# EAGLE design packaged (EAGLE 7.6.0)
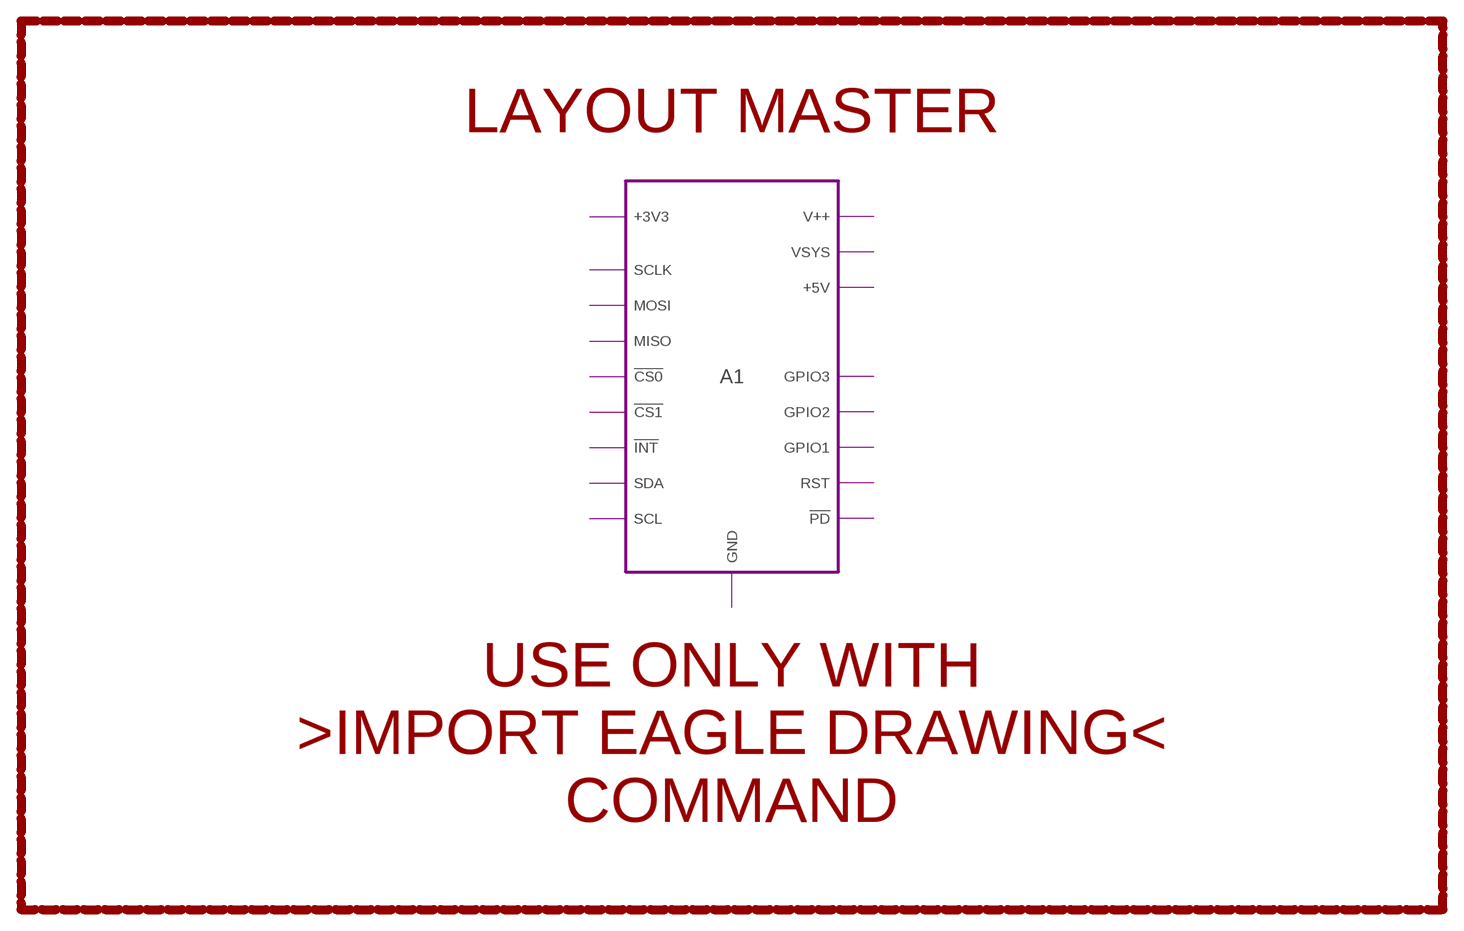
[diagram p0: schematic, sheet 1]

## Module instances
A1 = X1-TRACKBOARD3080

## Notes on the sheet
- LAYOUT MASTER
- USE ONLY WITH
  >IMPORT EAGLE DRAWING<
  COMMAND

## Library data of the parts

## Module X1-TRACKBOARD3080
Ports: !CS0(io) SCLK(io) MOSI(io) MISO(io) !CS1(io) !INT(io) SDA(io) SCL(io) GND(io) !PD(io) RST(io) GPIO1(io) GPIO2(io) GPIO3(io) +3V3(io) +5V(io) VSYS(io) V++(io)
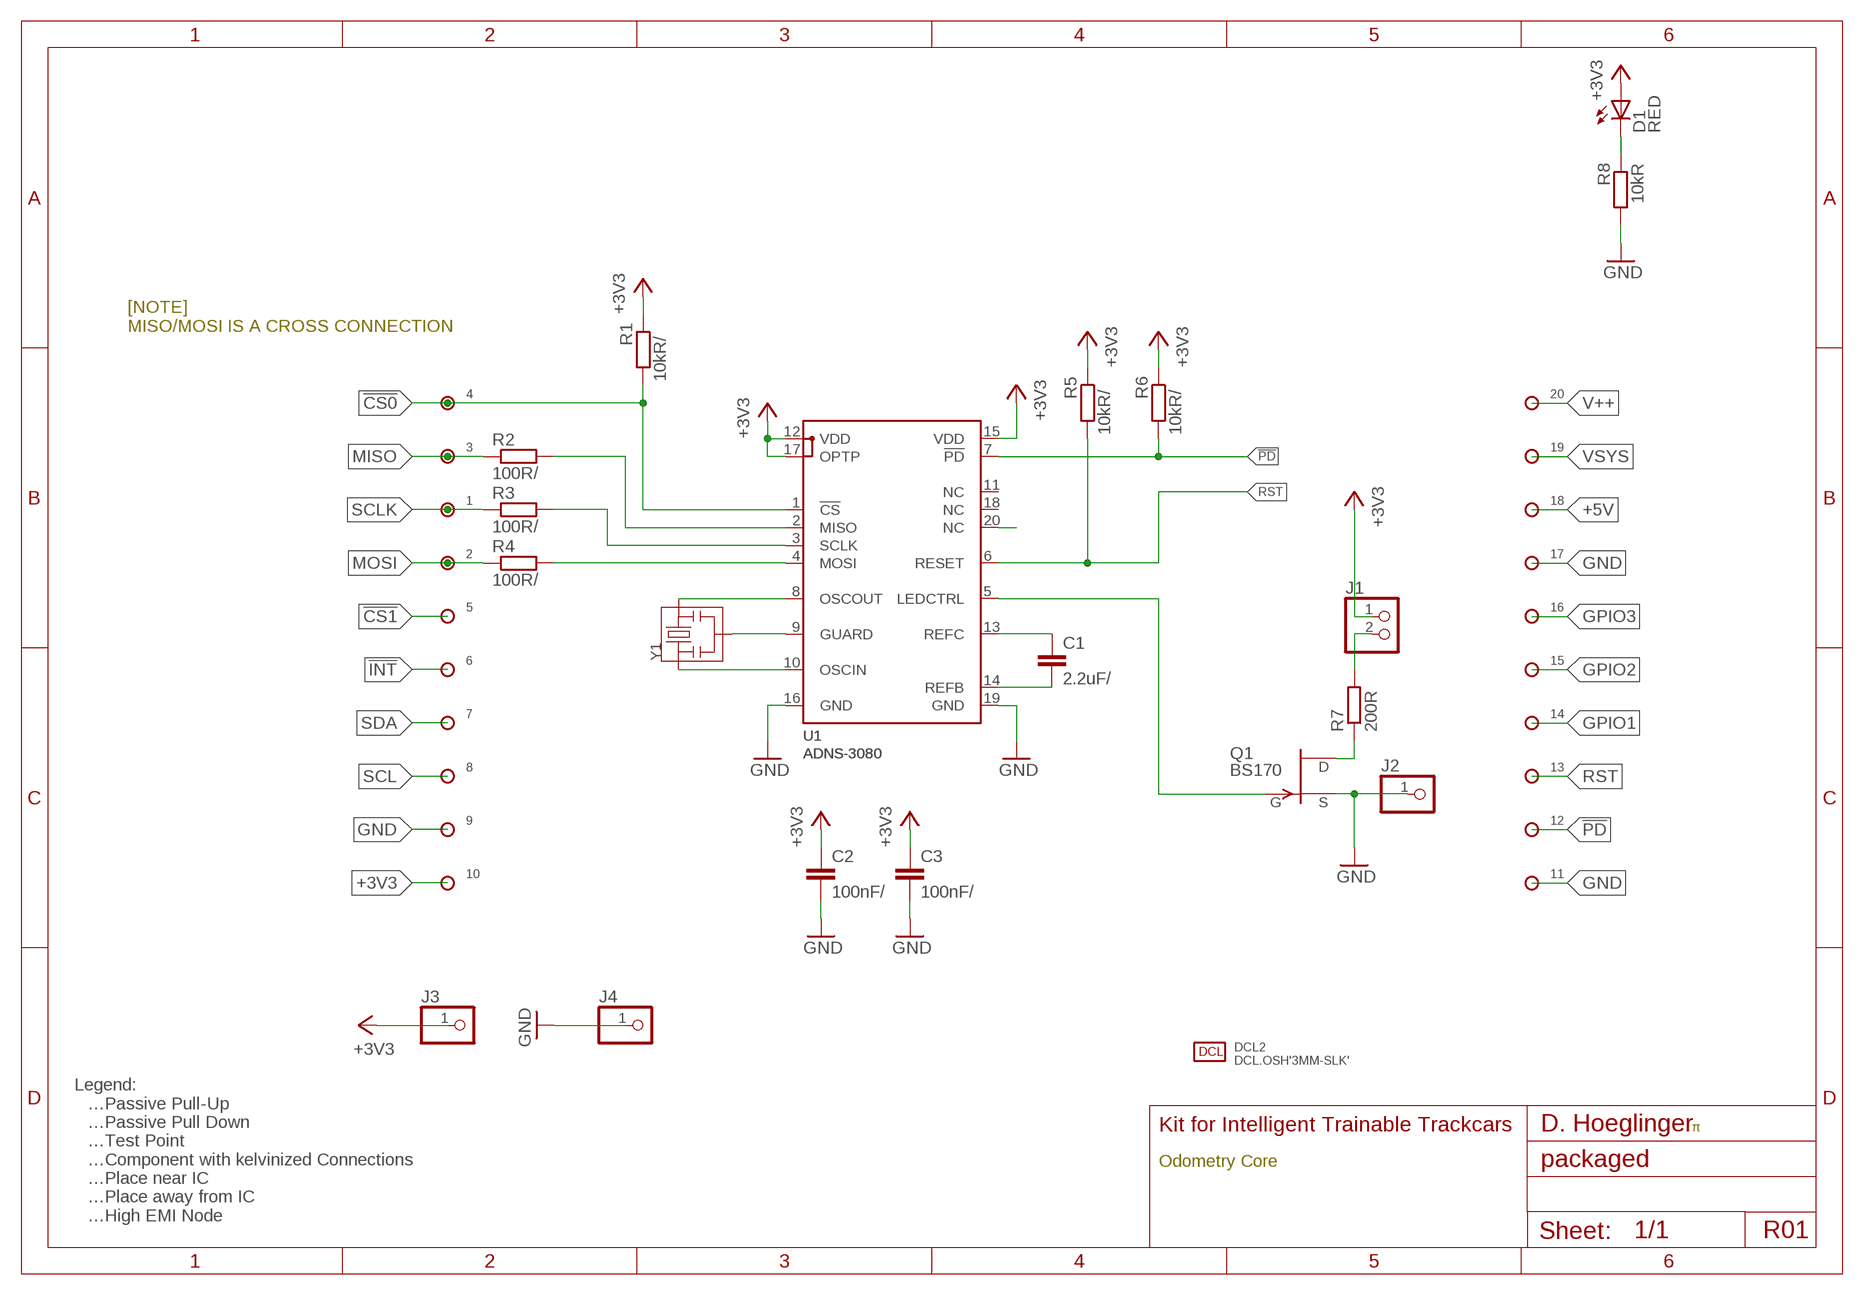
[diagram p1: schematic, module X1-TRACKBOARD3080, sheet 1]

### Parts
C1  2.2uF/⇤  C-EUC1608  [C1608]
C2  100nF/⇤  C-EUC0805K  [C0805K]
C3  100nF/⇤  C-EUC0805K  [C0805K]
D1  RED  LEDCHIP-LED0805  [CHIP-LED0805]
DCL2  DCL.OSH'3MM-SLK'  [DCL.LOGO-OSH.3MM]
J1  PINHD-1X2  [1X02]
J2  PINHD-1X1  [1X01]
J3  PINHD-1X1  [1X01]
J4  PINHD-1X1  [1X01]
Q1  BS170  SST5484  [SOT23]
R1  10kR/⎒  R-EU_R0402  [R0402]
R2  100R/⇤  R-EU_R0402  [R0402]
R3  100R/⇤  R-EU_R0402  [R0402]
R4  100R/⇤  R-EU_R0402  [R0402]
R5  10kR/⎒  R-EU_R0402  [R0402]
R6  10kR/⎒  R-EU_R0402  [R0402]
R7  200R  R-EU_R0805  [R0805]
R8  10kR  R-EU_R0402  [R0402]
U1  ADNS-3080  [ADNS-3080]
U$1  SIGNATURE  [SIG_DOMH]
Y1  24MHz  RESON  [RESON-SMD]
⌁1  SINGLEPAD40MIL  [PAD40MIL]
⌁2  SINGLEPAD40MIL  [PAD40MIL]
⌁3  SINGLEPAD40MIL  [PAD40MIL]
⌁4  SINGLEPAD40MIL  [PAD40MIL]
⌁5  SINGLEPAD40MIL  [PAD40MIL]
⌁6  SINGLEPAD40MIL  [PAD40MIL]
⌁7  SINGLEPAD40MIL  [PAD40MIL]
⌁8  SINGLEPAD40MIL  [PAD40MIL]
⌁9  SINGLEPAD40MIL  [PAD40MIL]
⌁10  SINGLEPAD40MIL  [PAD40MIL]
⌁11  SINGLEPAD40MIL  [PAD40MIL]
⌁12  SINGLEPAD40MIL  [PAD40MIL]
⌁13  SINGLEPAD40MIL  [PAD40MIL]
⌁14  SINGLEPAD40MIL  [PAD40MIL]
⌁15  SINGLEPAD40MIL  [PAD40MIL]
⌁16  SINGLEPAD40MIL  [PAD40MIL]
⌁17  SINGLEPAD40MIL  [PAD40MIL]
⌁18  SINGLEPAD40MIL  [PAD40MIL]
⌁19  SINGLEPAD40MIL  [PAD40MIL]
⌁20  SINGLEPAD40MIL  [PAD40MIL]

### Nets
!CS0: R1.2 U1.1(!CS) ⌁4.X
!CS1: ⌁5.X
!INT: ⌁6.X
!PD: R6.2 U1.7(!PD) ⌁12.X
+3V3: C2.1 C3.1 D1.A J1.1 J3.1 R1.1 R5.1 R6.1 U1.12(VDD) U1.15(VDD) U1.17(OPTP) ⌁10.X
+5V: ⌁18.X
GND: C2.2 C3.2 J2.1 J4.1 Q1.2(S) R8.2 U1.16(GND) U1.19(GND) ⌁9.X ⌁11.X ⌁17.X
GPIO1: ⌁14.X
GPIO2: ⌁15.X
GPIO3: ⌁16.X
MISO: R2.1 ⌁3.X
MOSI: R4.1 ⌁2.X
N$4: Q1.3(G) U1.5(LEDCTRL)
N$5: C1.1 U1.13(REFC)
N$6: C1.2 U1.14(REFB)
N$7: Q1.1(D) R7.1
N$8: J1.2 R7.2
N$9: U1.20(NC)
N$11: D1.C R8.1
RST: R5.2 U1.6(RESET) ⌁13.X
SCL: ⌁8.X
SCLK: R3.1 ⌁1.X
SDA: ⌁7.X
U1.GUARD: U1.9(GUARD) Y1.2
U1.MISO: R2.2 U1.2(MISO)
U1.MOSI: R4.2 U1.4(MOSI)
U1.OSCIN✳: U1.10(OSCIN) Y1.1
U1.OSCOUT✳: U1.8(OSCOUT) Y1.3
U1.SCLK: R3.2 U1.3(SCLK)
V++: ⌁20.X
VSYS: ⌁19.X
Unconnected: U1.11(NC) U1.18(NC)

### Notes on the sheet
- [NOTE]
  MISO/MOSI IS A CROSS CONNECTION
- Legend:
  ⎒…Passive Pull-Up
  ⎑…Passive Pull Down
  ☇…Test Point
  ⚻…Component with kelvinized Connections
  ⇤…Place near IC
  ↦…Place away from IC
  ✳…High EMI Node
- Kit for Intelligent Trainable Trackcars | D. Hoeglinger
- Odometry Core
- R01

### Library data of the parts
C1-C3 = rcl:C-EU: CAPACITOR, European symbol
D1 = led:LED: LED OSRAM: - CHIPLED LG R971, LG N971, LY N971, LG Q971, LY Q971, LO R971, LY R971 LH N974, LH R974 LS Q976, LO Q976, LY Q976 LO Q996 - Hyper CHIPLED LW Q18S LB Q993, LB Q99A, LB R99A - SideLED LS A670, LO A670, LY A670, LG A670, LP A670 LB A673, LV A673, LT A673, LW A673 LH A674 LY A675 LS A676, LA A676, LO A676, LY A676, LW A676 LS A679, LY A679, LG A679 - Hyper Micro SIDELED® LS Y876, LA Y876, LO Y876, LY Y876 LT Y87S - SmartLED LW L88C, LW L88S LB L89C, LB L89S, LG L890 LS L89K, LO L89K, LY L89K LS L896, LA L896, LO L896, LY L896 - TOPLED LS T670, LO T670, LY T670, LG T670, LP T670 LSG T670, LSP T670, LSY T670, LOP T670, LYG T670 LG T671, LOG T671, LSG T671 LB T673, LV T673, LT T673, LW T673 LH T674 LS T676, LA T676, LO T676, LY T676, LB T676, LH T676, LSB T676, LW T676 LB T67C, LV T67C, LT T67C, LS T67K, LO T67K, LY T67K, LW E67C LS E67B, LA E67B, LO E67B, LY E67B, LB E67C, LV E67C, LT E67C LW T67C LS T679, LY T679, LG T679 LS T770, LO T770, LY T770, LG T770, LP T770 LB T773, LV T773, LT T773, LW T773 LH T774 LS E675, LA E675, LY E675, LS T675 LS T776, LA T776, LO T776, LY T776, LB T776 LHGB T686 LT T68C, LB T68C - Hyper Mini TOPLED® LB M676 - Mini TOPLED Santana® LG M470 LS M47K, LO M47K, LY M47K Source: http://www.osram.convergy.de LUXEON: - LUMILED® LXK2-PW12-R00, LXK2-PW12-S00, LXK2-PW14-U00, LXK2-PW14-V00 LXK2-PM12-R00, LXK2-PM12-S00, LXK2-PM14-U00 LXK2-PE12-Q00, LXK2-PE12-R00, LXK2-PE12-S00, LXK2-PE14-T00, LXK2-PE14-U00 LXK2-PB12-K00, LXK2-PB12-L00, LXK2-PB12-M00, LXK2-PB14-N00, LXK2-PB14-P00, LXK2-PB14-Q00 LXK2-PR12-L00, LXK2-PR12-M00, LXK2-PR14-Q00, LXK2-PR14-R00 LXK2-PD12-Q00, LXK2-PD12-R00, LXK2-PD12-S00 LXK2-PH12-R00, LXK2-PH12-S00 LXK2-PL12-P00, LXK2-PL12-Q00, LXK2-PL12-R00 Source: www.luxeon.com KINGBRIGHT: KA-3528ASYC Source: www.kingbright.com
DCL2 = kitt.refs:DCL.OSH
J1 = pinhead:PINHD-1X2: PIN HEADER
J2-J4 = pinhead:PINHD-1X1: PIN HEADER
Q1 = transistor-fet:?548*: N-Channel JFETs Source: VISHAY 2N5484.pdf Compatible: TO92 2N5245 J304 J305 U310 J308 J309 J310 TO72 2N4416 2N4416A 2N3823 2N4351 3N169 3N170 3N171 MFE3002 TO18 2N3796 2N3797 MFE825 Source: Motorola European Master Guide Pacge 3-59
R1-R8 = rcl:R-EU_: RESISTOR, European symbol
U1 = kitt.ic:ADNS-3080
U$1 = decals:SIGNATURE
Y1 = Ai_Passives:RESON
⌁1-⌁20 = kitt.con:SINGLEPAD

## Board
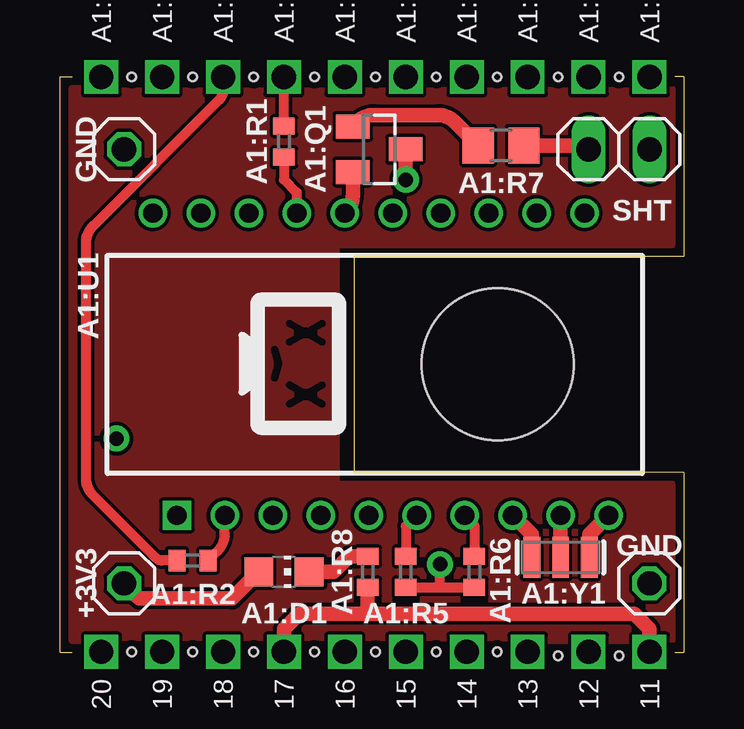
[diagram p2: board, top side]
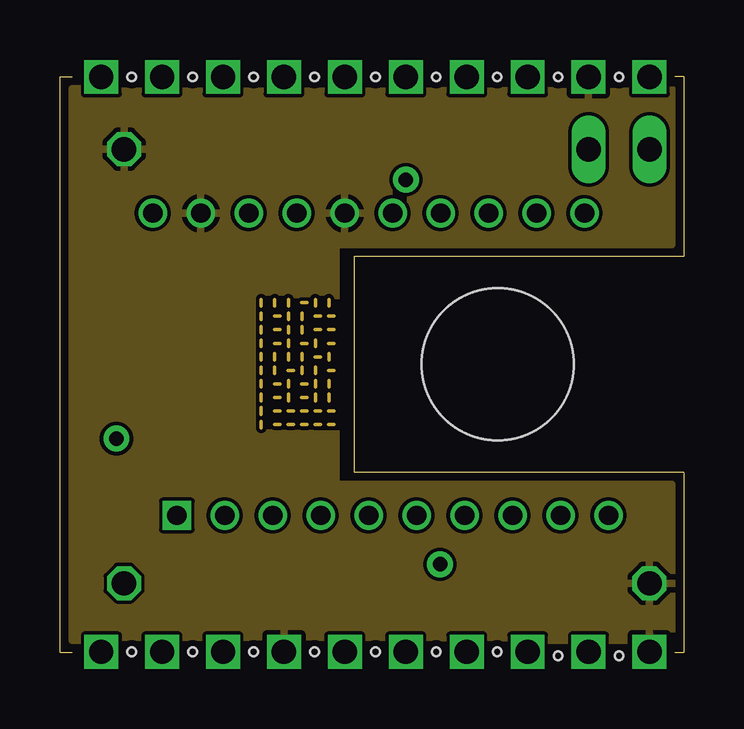
[diagram p3: board, inner layer Route2]
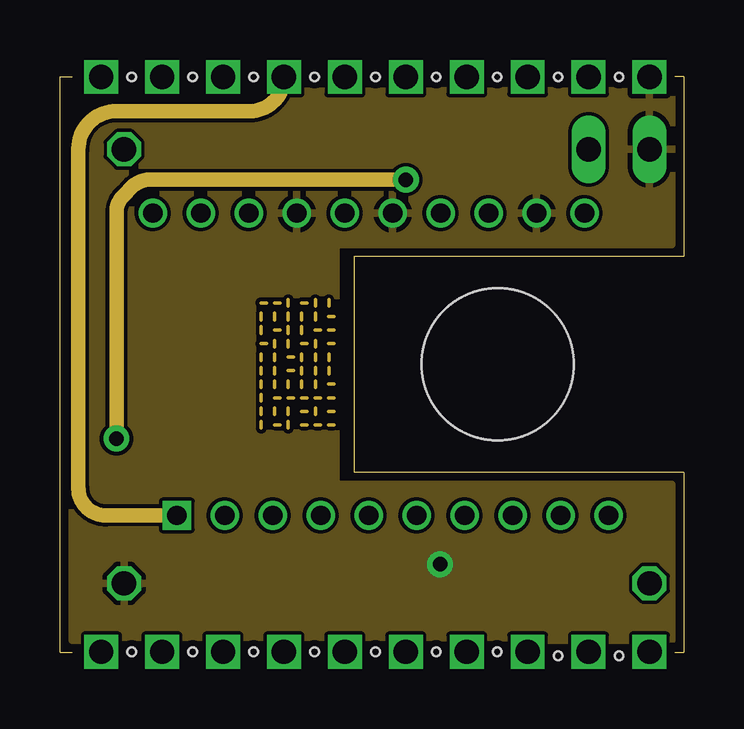
[diagram p4: board, inner layer Route15]
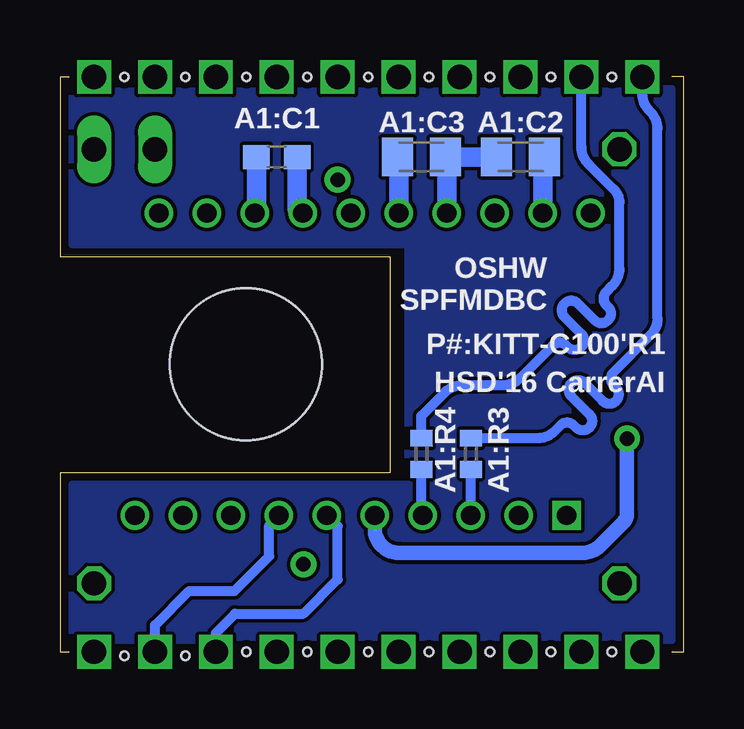
[diagram p5: board, bottom side, seen from below]

Size 26 x 24 mm. Coordinates in mm from the lower left corner, seen from the top.
Outline: 25.62,0 26,0 26,7.5 12.25,7.5 12.25,16.5 26,16.5 26,24 25.62,24
Outline: 0.5,0 0,0 0,24 0.5,24
Copper layers (1+2*15+16): Top 0.035mm / dielectric 0.38mm / Route2 0.035mm / dielectric 0.71mm / Route15 0.035mm / dielectric 0.38mm / Bottom 0.035mm
Design rules "PCB-POOL Standard_ML4": minimum track width 0.15mm, minimum drill 0.3mm, track to track 0.15mm, track to pad 0.15mm, pad to pad 0.15mm, via to via 0.15mm, smd to smd 0.15mm, copper to edge 0.3mm, drill to drill 0.2mm, minimum pad ring 0.2mm, minimum via ring 0.15mm, stop-mask expansion 0.075mm, vias tented up to drill 0mil, thermal gap 0.2mm
Holes 0.35 mm at 2.99,23.98 5.53,23.98 8.07,23.98 10.61,23.98 13.15,23.98 15.69,23.98 18.23,23.98 20.77,23.98 23.31,23.98 23.31,-0.15 20.77,-0.15 18.23,0.01 15.69,0.01 13.15,0.01 10.61,0.01 8.07,0.01 5.53,0.01 2.99,0.01

### Footprints (pad centres in the part's own frame; a part is rotated, then mirrored left to right if it is on the bottom)
C1608 = smd 1.1 x 1: 1 -0.85,0; 2 0.85,0
C0805K = smd 1.3 x 1.6: 1 -1,0; 2 1,0
CHIP-LED0805 = smd 1.2 x 1.2: A 0,-1.05; C 0,1.05
1X02 = drill 1.016 long: 1 -1.27,0; 2 1.27,0
1X01 = drill 1.016 octagon: 1 0,0
SOT23 = smd 1 x 1.4: 1 -0.95,-1.1; 2 0.95,-1.1; 3 0,1.1
R0402 = smd 0.7 x 0.9: 1 -0.65,0; 2 0.65,0
R0805 = smd 1.3 x 1.5: 1 -0.95,0; 2 0.95,0
ADNS-3080 = drill 0.8 square: 1 -8.126,-6.3 | drill 0.8: 2 -6.126,-6.3; 3 -4.126,-6.3; 4 -2.126,-6.3; 5 -0.126,-6.3; 6 1.874,-6.3; 7 3.874,-6.3; 8 5.874,-6.3; 9 7.874,-6.3; 10 9.874,-6.3; 11 8.874,6.3; 12 6.874,6.3; 13 4.874,6.3; 14 2.874,6.3; 15 0.874,6.3; 16 -1.126,6.3; 17 -3.126,6.3; 18 -5.126,6.3; 19 -7.126,6.3; 20 -9.126,6.3 | hole 6.35: 5.254,0
RESON-SMD = smd 0.7 x 1.7: 1 -1.2,0; 2 0,0; 3 1.2,0
PAD40MIL = drill 1.016 square: X 0,0

### Placement (x,y rotation side)
A1:C1  2.2uF/⇤  [C1608]  16.96,20.65 0 bottom
A1:C2  100nF/⇤  [C0805K]  6.8,20.65 0 bottom
A1:C3  100nF/⇤  [C0805K]  10.93,20.65 180 bottom
A1:D1  RED  [CHIP-LED0805]  9.34,3.34 270 top
A1:DCL2  DCL.OSH'3MM-SLK'  [DCL.LOGO-OSH.3MM]  3.62,15.23 180 top
A1:J1  [1X02]  23.31,20.96 180 top
A1:J2  [1X01]  2.67,20.96 0 top
A1:J3  [1X01]  2.67,2.87 0 top
A1:J4  [1X01]  24.58,2.87 0 top
A1:Q1  BS170  [SOT23]  13.31,20.96 270 top
A1:R1  10kR/⎒  [R0402]  9.34,21.28 90 top
A1:R2  100R/⇤  [R0402]  5.53,3.82 0 top
A1:R3  100R/⇤  [R0402]  8.86,8.27 270 bottom
A1:R4  100R/⇤  [R0402]  10.93,8.27 270 bottom
A1:R5  10kR/⎒  [R0402]  14.42,3.34 90 top
A1:R6  10kR/⎒  [R0402]  17.28,3.34 90 top
A1:R7  200R  [R0805]  18.39,21.12 0 top
A1:R8  10kR  [R0402]  12.83,3.34 270 top
A1:U1  ADNS-3080  [ADNS-3080]  13,12 0 top
A1:U$1  SIGNATURE  [SIG_DOMH]  10,12 270 top
A1:Y1  24MHz  [RESON-SMD]  20.87,3.95 180 top
A1:⌁1  SINGLEPAD40MIL  [PAD40MIL]  1.72,23.98 270 top
A1:⌁2  SINGLEPAD40MIL  [PAD40MIL]  4.26,23.98 270 top
A1:⌁3  SINGLEPAD40MIL  [PAD40MIL]  6.8,23.98 270 top
A1:⌁4  SINGLEPAD40MIL  [PAD40MIL]  9.34,23.98 270 top
A1:⌁5  SINGLEPAD40MIL  [PAD40MIL]  11.88,23.98 270 top
A1:⌁6  SINGLEPAD40MIL  [PAD40MIL]  14.42,23.98 270 top
A1:⌁7  SINGLEPAD40MIL  [PAD40MIL]  16.96,23.98 270 top
A1:⌁8  SINGLEPAD40MIL  [PAD40MIL]  19.5,23.98 270 top
A1:⌁9  SINGLEPAD40MIL  [PAD40MIL]  22.04,23.98 270 top
A1:⌁10  SINGLEPAD40MIL  [PAD40MIL]  24.58,23.98 270 top
A1:⌁11  SINGLEPAD40MIL  [PAD40MIL]  24.58,0.01 90 top
A1:⌁12  SINGLEPAD40MIL  [PAD40MIL]  22.04,0.01 90 top
A1:⌁13  SINGLEPAD40MIL  [PAD40MIL]  19.5,0.01 90 top
A1:⌁14  SINGLEPAD40MIL  [PAD40MIL]  16.96,0.01 90 top
A1:⌁15  SINGLEPAD40MIL  [PAD40MIL]  14.42,0.01 90 top
A1:⌁16  SINGLEPAD40MIL  [PAD40MIL]  11.88,0.01 90 top
A1:⌁17  SINGLEPAD40MIL  [PAD40MIL]  9.34,0.01 90 top
A1:⌁18  SINGLEPAD40MIL  [PAD40MIL]  6.8,0.01 90 top
A1:⌁19  SINGLEPAD40MIL  [PAD40MIL]  4.26,0.01 90 top
A1:⌁20  SINGLEPAD40MIL  [PAD40MIL]  1.72,0.01 90 top

### Tracks (layer width: path | path; a pad name or v marks a point on that pad's centre or on a via)
A1:!CS0
  Top 0.406: A1:R1.2 A1:⌁4.X
  Route15 0.61: A1:U1.1 1.91,5.7 arc-90 0.77,6.84 0.77,20.96 arc-90 2.35,22.55 7.91,22.55 arc90 A1:⌁4.X
A1:!PD
  Top 0.406: A1:U1.7 17.28,5.29 A1:R6.2
  Bottom 0.406: A1:⌁12.X 22.04,1.12 20.61,2.55 18.72,2.55 A1:R6.2 17.28,5.29 A1:U1.7
A1:+3V3  (via drill 0.6)
  Top 0.406: A1:R5.1 15.85,2.69 | 15.85,2.69 v15.85,3.66 | 15.85,2.69 A1:R6.1 | A1:R1.1 9.34,19.7 9.87,19.16 A1:U1.17
  Top 0.61: A1:D1.A 7.18,2.23 3.31,2.23 A1:J3.1
  Bottom 0.813: A1:C2.1 A1:C3.1 9.87,20.65 A1:U1.17
  pour Route15: 0.5,23.5 0.5,0.5 25.5,0.5 25.5,7 11.5,7 11.5,17 25.5,17 25.5,23.5
A1:GND
  Top 0.61: A1:R8.2 12.83,1.6 | 12.83,1.6 9.97,1.6 9.34,0.96 A1:⌁17.X | A1:⌁11.X 24.58,0.96 23.95,1.6 12.83,1.6 | A1:Q1.2 12.21,19.05 arc-45 11.92,18.34 A1:U1.16
  Bottom 0.813: A1:C2.2 5.87,20.65 A1:U1.19 | A1:C3.2 11.87,20.65 A1:U1.16
  pour Route2: 0.5,23.5 0.5,0.5 25.5,0.5 25.5,7 11.5,7 11.5,17 25.5,17 25.5,23.5
A1:GND1
  pour Bottom: 0.5,23.5 0.5,0.5 25.5,0.5 25.5,7 11.5,7 11.5,17 25.5,17 25.5,23.5
A1:GND2
  pour Top: 0.5,23.5 0.5,0.5 25.5,0.5 25.5,7 11.5,7 11.5,17 25.5,17 25.5,23.5
A1:MISO
  Top 0.406: A1:R2.1 4.26,3.82 arc-45 3.99,3.93 1.38,6.54 arc-45 1.08,7.25 1.08,17.06 arc-45 1.38,17.77 6.64,23.03 arc45 6.8,23.41 A1:⌁3.X
A1:MOSI
  Bottom 0.406: A1:R4.1 10.93,9.85 9.95,10.83 arc45 9.24,11.12 7.53,11.12 arc-45 6.83,11.41 5.45,12.79 arc90 4.9,12.79 4.82,12.71 arc-90 4.27,12.71 4.26,12.72 arc-90 4.26,13.27 4.97,13.98 arc90 4.97,14.53 4.96,14.54 arc90 4.41,14.54 3.7,13.83 arc-90 3.15,13.83 3.14,13.84 arc-90 3.14,14.39 3.22,14.47 arc90 3.22,15.02 2.96,15.28 arc-45 2.67,15.98 2.67,18.74 arc-45 2.9,19.29 3.97,20.36 arc45 4.26,21.06 A1:⌁2.X
A1:N$4  (via drill 0.6)
  Top 0.61: v14.42,19.7 arc-90 14.41,19.86 A1:Q1.3
  Route15 0.61: v2.35,8.9 2.35,18.33 arc-45 2.65,19.04 3.02,19.4 arc-45 3.72,19.7 v14.42,19.7
  Bottom 0.61: A1:U1.5 12.87,5.14 arc-90 11.87,4.14 4.2,4.14 arc-45 3.49,4.43 2.51,5.41 arc-45 2.35,5.79 v2.35,8.9
A1:N$5
  Bottom 0.813: A1:C1.1 17.81,18.36 arc90 A1:U1.13
A1:N$6
  Bottom 0.813: A1:C1.2 16.11,18.54 arc-90 A1:U1.14
A1:N$7
  Top 0.61: A1:Q1.1 12.39,22.1 arc-45 13.1,22.39 15.76,22.39 arc-45 16.46,22.1 A1:R7.1
A1:N$8
  Top 0.61: A1:R7.2 21.66,21.12 arc-45 A1:J1.2
A1:N$11
  Top 0.61: A1:D1.C 11.4,3.34 12.05,3.99 A1:R8.1
A1:RST
  Top 0.406: A1:U1.6 14.42,5.25 A1:R5.2
  Bottom 0.406: A1:⌁13.X 19.5,0.8 18.71,1.6 15.85,1.6 14.42,3.03 14.42,5.25 A1:U1.6
A1:SCLK
  Bottom 0.406: 8.83,8.9 arc45 A1:R3.1 6.09,8.91 arc-45 5.38,9.21 5.13,9.46 arc90 4.58,9.46 4.48,9.36 arc-90 3.93,9.36 3.93,9.36 arc-90 3.93,9.91 4.68,10.66 arc90 4.68,11.21 4.67,11.22 arc90 4.12,11.22 3.37,10.47 arc-90 2.82,10.47 2.81,10.47 arc-90 2.81,11.03 2.91,11.12 arc90 2.91,11.68 1.38,13.21 arc-45 1.08,13.92 1.08,21.82 arc-45 1.38,22.53 1.43,22.58 arc45 1.72,23.28 A1:⌁1.X
A1:U1.GUARD
  Top 0.61: A1:Y1.2 A1:U1.9
A1:U1.MISO
  Top 0.406: A1:R2.2 6.58,4.22 arc45 6.87,4.93 A1:U1.2
A1:U1.MOSI
  Bottom 0.406: A1:U1.4 arc45 10.93,5.83 A1:R4.2
A1:U1.OSCIN✳
  Top 0.61: A1:Y1.1 22.07,4.9 A1:U1.10
A1:U1.OSCOUT✳
  Top 0.61: A1:Y1.3 19.67,4.9 A1:U1.8
A1:U1.SCLK
  Bottom 0.406: A1:U1.3 arc-45 8.86,5.72 A1:R3.2

### Text on the board
tNames: GND | SHT | GND | +3V3
bNames: OSHW / SPFMDBC | P#:KITT-C100'R1 | HSD'16 CarrerAI